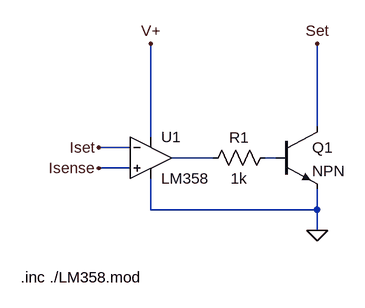
[diagram p0: schematic Ilim.asc]
Ilim.asc, the LTspice schematic file:
Version 4
SHEET 1 880 680
WIRE 384 176 384 48
WIRE 128 192 128 48
WIRE 96 208 48 208
WIRE 224 224 160 224
WIRE 320 224 304 224
WIRE 96 240 48 240
WIRE 128 304 128 256
WIRE 384 304 384 272
WIRE 384 304 128 304
WIRE 384 336 384 304
FLAG 384 336 0
FLAG 128 48 V+
FLAG 48 208 Iset
FLAG 48 240 Isense
FLAG 384 48 Set
SYMBOL opamp2 128 160 R0
SYMATTR InstName U1
SYMATTR Value LM358
SYMBOL res 320 208 R90
WINDOW 0 0 56 VBottom 2
WINDOW 3 32 56 VTop 2
SYMATTR InstName R1
SYMATTR Value 1k
SYMBOL npn 320 176 R0
SYMATTR InstName Q1
TEXT -72 408 Left 2 !.inc ./LM358.mod

The netlist it stands for:
* Ilim.asc
XU1 Isense Iset V+ 0 N001 LM358  ; pins In+ In- V+ V- OUT
R1 N002 N001 1k
Q1 Set N002 0 0 NPN
.model NPN NPN
.model PNP PNP
.lib standard.bjt
.inc ./LM358.mod
.backanno
.end